# Altium schematic sheet MCU_Debug.SchDoc
size A4
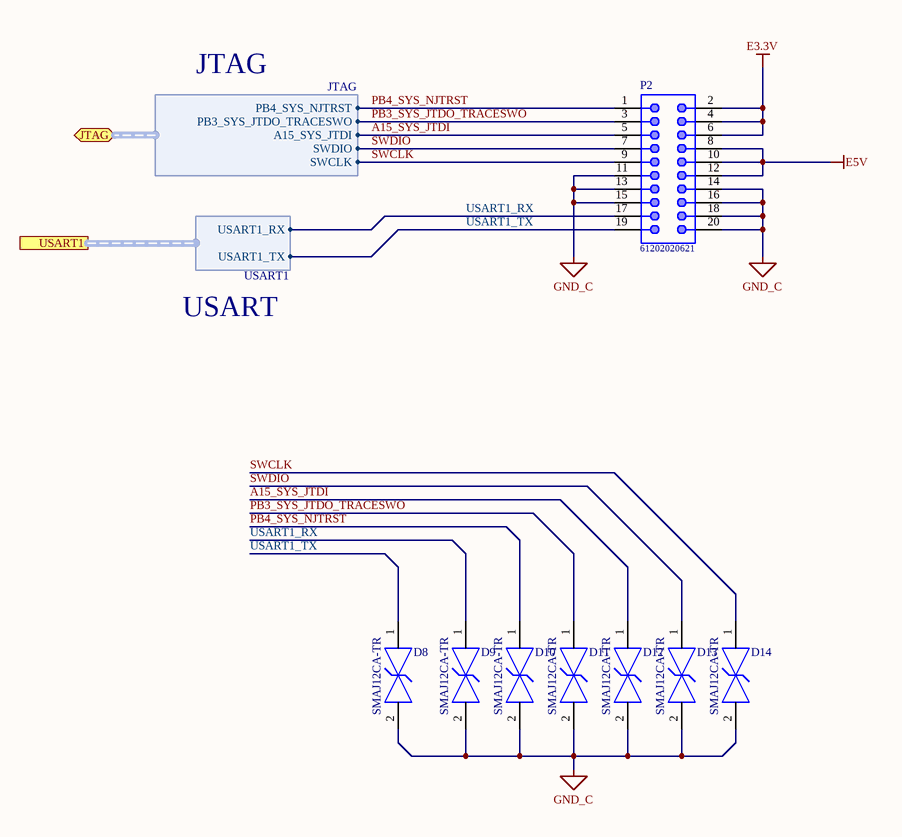
[diagram p0: MCU_Debug.SchDoc]

## Parts
D8  SMAJ12CA-TR  [FP-SMA-CA-MFG]
D9  SMAJ12CA-TR  [FP-SMA-CA-MFG]
D10  SMAJ12CA-TR  [FP-SMA-CA-MFG]
D11  SMAJ12CA-TR  [FP-SMA-CA-MFG]
D12  SMAJ12CA-TR  [FP-SMA-CA-MFG]
D13  SMAJ12CA-TR  [FP-SMA-CA-MFG]
D14  SMAJ12CA-TR  [FP-SMA-CA-MFG]
P2  61202020621  [61202020621]

## Ports
JTAG (bidir, harness JTAG), USART1 (harness USART1)

## Harnesses
JTAG: PB3_SYS_JTDO_TRACESWO, PB4_SYS_NJTRST, SWDIO, SWCLK, A15_SYS_JTDI
USART1: USART1_RX, USART1_TX

## Nets
E3.3V: P2.2 P2.4 P2.6
E5V: P2.8 P2.10 P2.12
GND_C: D8.2 D9.2 D10.2 D11.2 D12.2 D13.2 D14.2 P2.11 P2.13 P2.14 P2.15 P2.16 P2.18 P2.20
A15_SYS_JTDI: D12.1 P2.5 ; port JTAG.A15_SYS_JTDI
PB3_SYS_JTDO_TRACESWO: D11.1 P2.3 ; port JTAG.PB3_SYS_JTDO_TRACESWO
PB4_SYS_NJTRST: D10.1 P2.1 ; port JTAG.PB4_SYS_NJTRST
SWCLK: D14.1 P2.9 ; port JTAG.SWCLK
SWDIO: D13.1 P2.7 ; port JTAG.SWDIO
USART1_RX: D9.1 P2.17 ; port USART1.USART1_RX
USART1_TX: D8.1 P2.19 ; port USART1.USART1_TX

## Notes on the sheet
- JTAG
- USART

## Library data of the parts
D8-D14 = CMP-12225-000045-1: TVS DIODE 12V 25.3V SMA; Manufacturer: STMicroelectronics; Number Of Channels: 1; Breakdown Voltage: 13.3V; Max Junction Temp: +150°C; Clamping Voltage: 19.9V; Peak Pulse Current: 20.1A; Description: 25.3V Clamp 91A (8/20µs) Ipp Tvs Diode Surface Mount SMA (DO-214AC); Standoff Height: 0.05mm; Peak Pulse Power: 400W; Direction: Bidirectional; Package: SMA-CA; Octopart: https://octopart.com/smaj12ca-tr-stmicroelectronics-347060; Device Class L3: unset; Automotive: No; Height: 2.65mm; Reverse Standoff Voltage: 12V; Mouser Description: TVS Diodes - Transient Voltage Suppressors 400W 12V Bidirect; Device Class L2: TVS Diodes; Lead Free: Yes; ComponentLink2URL: https://www.st.com/resource/en/datasheet/smaj.pdf; Digikey Description: TVS DIODE 12V 25.3V SMA; Temperature Range High: +150°C; RoHS: TRUE; Device Class L1: Circuit Protection; Temperature Range Low: -55°C; Temperature: -55°C to +150°C; Category: Diode; ComponentLink2Description: Datasheet; Manufacturer Part Number: SMAJ12CA-TR
P2 = 61202020621: Male Box Header WR-BHD, SMT, Vertical, pitch 2.54 mm, 20 pins; Pitch: 2.54 mm; Working Voltage: 250 VAC; Withstanding Voltage: 500 VAC; Contact Resistance: 20 mOhm; Pin Number: 20; ComponentLink1Description: Manufacturer; ComponentLink1URL: http://www.we-online.de; ComponentLink2Description: Datasheet; ComponentLink2URL: https://katalog.we-online.de/em/datasheet/6120xx20621.pdf; Part Number: 61202020621; Published Date: August 2018; Publisher: Wurth Elektronik; Operating Temperature: -40 to 125 degC; Packaging: Tube; Gender: Male; Mounting Technology: SMT; Orientation: Vertical